# Altium schematic sheet CAN_transciever.SchDoc
size A4; SheetNumber: 3; SheetTotal: 11
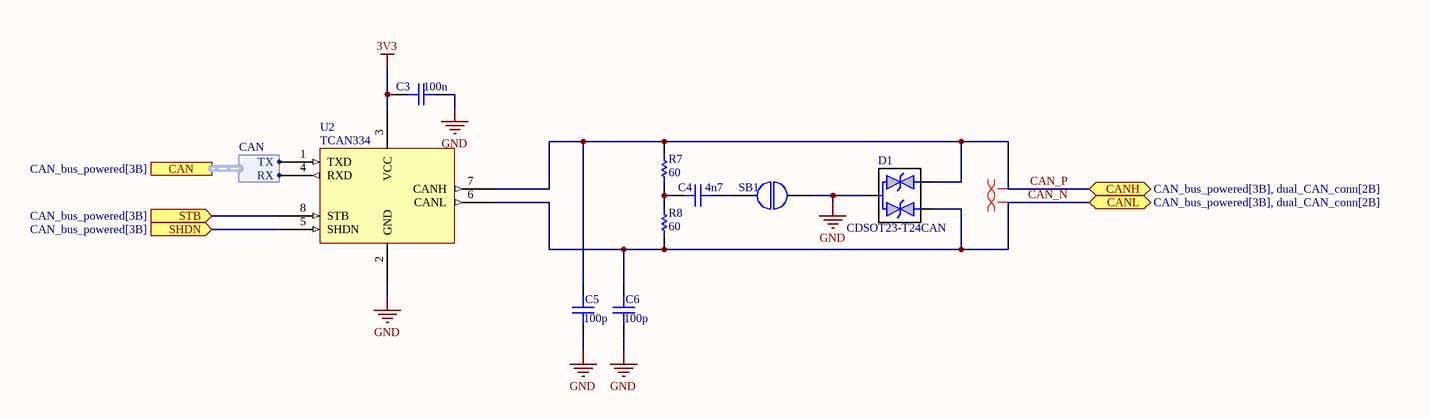
[diagram p0: CAN_transciever.SchDoc]

## Parts
C3  100n  [CAP-0603-NP]
C4  4n7  [CAP-0603-NP]
C5  100p  [CAP-0603-NP]
C6  100p  [CAP-0603-NP]
D1  CDSOT23-T24CAN  [SOT23127P600-8N]
R7  60  [RES-0603]
R8  60  [RES-0603]
SB1  NO Solder Bridge  [Solder Bridge]  (value not drawn)
U2  TCAN334  [ST SOT23-5L]

## Ports
CAN (harness CAN, see CAN_bus_powered[3B]), CANH (bidir, see CAN_bus_powered[3B], dual_CAN_conn[2B]), CANL (bidir, see CAN_bus_powered[3B], dual_CAN_conn[2B]), SHDN (in, see CAN_bus_powered[3B]), STB (in, see CAN_bus_powered[3B])

## Harnesses
CAN: TX, RX

## Nets
3V3: C3.2 U2.3(VCC)
GND: C3.1 C5.2 C6.2 D1.3 SB1.1 U2.2(GND)
CAN_N: C6.1 D1.1 R8.2 U2.6(CANL) ; port CANL
CAN_P: C5.1 D1.2 R7.1 U2.7(CANH) ; port CANH
SHDN: U2.5(SHDN) ; port SHDN
STB: U2.8(STB) ; port STB
NetC4_1: C4.1 SB1.2
NetC4_2: C4.2 R7.2 R8.1
NetU2_1: U2.1(TXD) ; port CAN.TX
NetU2_4: U2.4(RXD) ; port CAN.RX

## Layout directives
differential pair: CAN_N, CAN_P

## Library data of the parts
C3-C6 = Capacitor
D1 = Dual TVS Diode
R7 R8 = Resistor
SB1 = NO Solder Bridge: Normally Open Solder Bridge
U2 = TCAN334: Can tranciever with shutdown and standby with wake